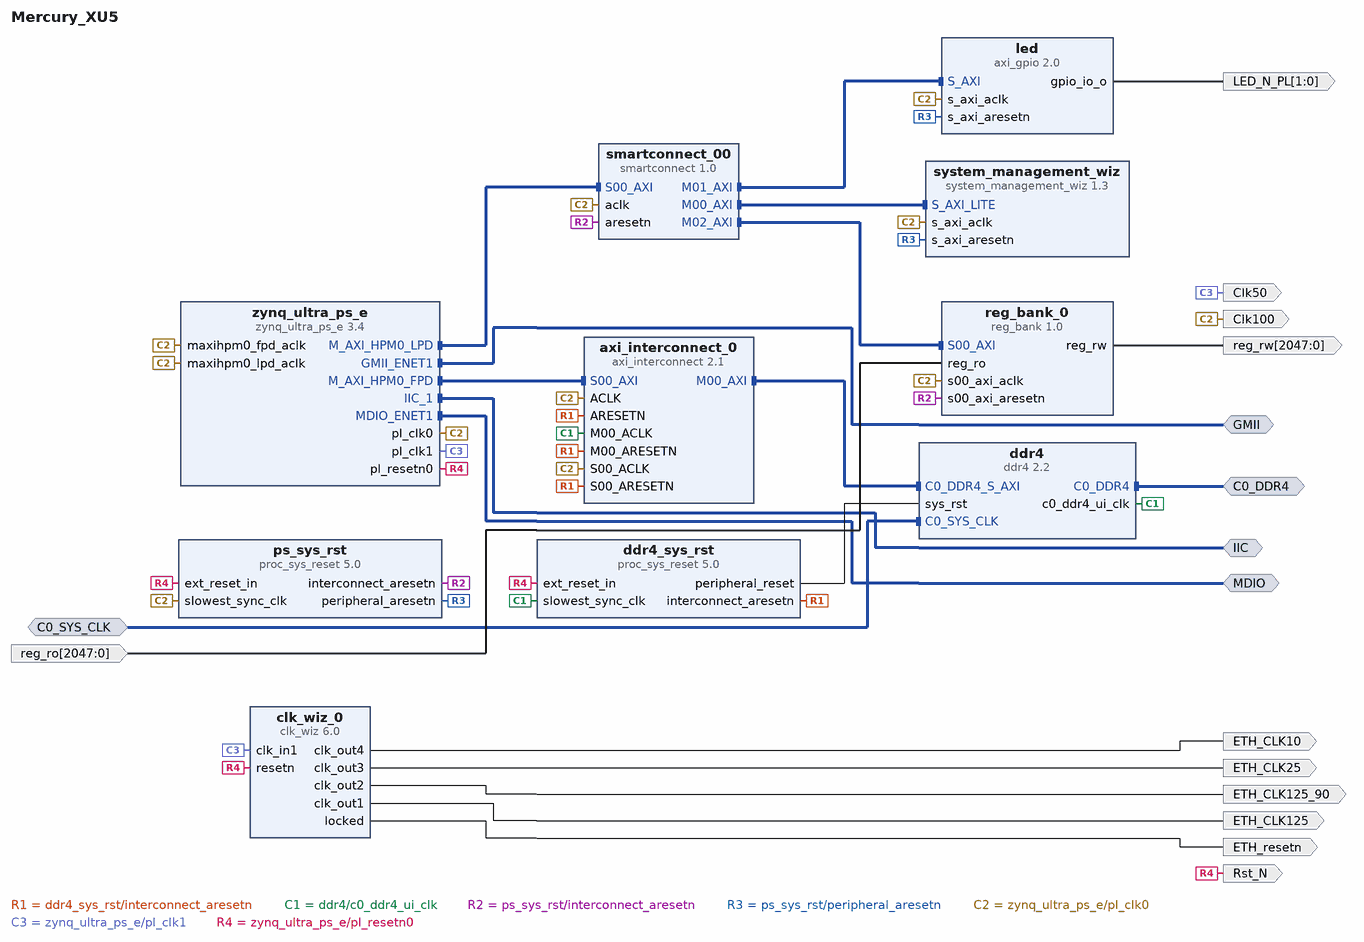
[diagram p0: block diagram of the top level]
# Vivado block design Mercury_XU5, xczu2eg-sfvc784-1-i, Vivado 2022.2
create_bd_design Mercury_XU5

create_bd_intf_port -mode Master -vlnv xilinx.com:interface:iic_rtl:1.0 IIC
create_bd_intf_port -mode Slave -vlnv xilinx.com:interface:diff_clock_rtl:1.0 C0_SYS_CLK
create_bd_intf_port -mode Master -vlnv xilinx.com:interface:ddr4_rtl:1.0 C0_DDR4
create_bd_intf_port -mode Master -vlnv xilinx.com:interface:gmii_rtl:1.0 GMII
create_bd_intf_port -mode Master -vlnv xilinx.com:interface:mdio_rtl:1.0 MDIO
create_bd_port -dir O -type clk ETH_CLK125
create_bd_port -dir O -type clk ETH_CLK125_90
create_bd_port -dir O -type clk ETH_CLK25
create_bd_port -dir O -type clk ETH_CLK10
create_bd_port -dir O ETH_resetn
create_bd_port -dir O -type clk Clk100
create_bd_port -dir O -type clk Clk50
create_bd_port -dir O -type rst Rst_N
create_bd_port -dir O -from 1 -to 0 LED_N_PL
create_bd_port -dir I -from 2047 -to 0 -type data reg_ro
create_bd_port -dir O -from 2047 -to 0 -type data reg_rw

create_bd_cell -type ip -vlnv xilinx.com:ip:zynq_ultra_ps_e:3.4 zynq_ultra_ps_e
set_property -dict [list \
  CONFIG.PSU_BANK_0_IO_STANDARD LVCMOS18 \
  CONFIG.PSU_BANK_1_IO_STANDARD LVCMOS18 \
  CONFIG.PSU_BANK_2_IO_STANDARD LVCMOS18 \
  CONFIG.PSU_BANK_3_IO_STANDARD LVCMOS18 \
  CONFIG.PSU_USB3__DUAL_CLOCK_ENABLE 1 \
  CONFIG.PSU__CRF_APB__DDR_CTRL__FREQMHZ 1200 \
  CONFIG.PSU__CRL_APB__PL1_REF_CTRL__FREQMHZ 50 \
  CONFIG.PSU__CRL_APB__QSPI_REF_CTRL__FREQMHZ 200 \
  CONFIG.PSU__CRL_APB__QSPI_REF_CTRL__SRCSEL RPLL \
  CONFIG.PSU__DDRC__BUS_WIDTH {64 Bit} \
  CONFIG.PSU__DDRC__DEVICE_CAPACITY {4096 MBits} \
  CONFIG.PSU__DDRC__DRAM_WIDTH {16 Bits} \
  CONFIG.PSU__DDRC__ECC Enabled \
  CONFIG.PSU__DDRC__SPEED_BIN DDR4_2400T \
  CONFIG.PSU__DDR_HIGH_ADDRESS_GUI_ENABLE 0 \
  CONFIG.PSU__DDR__INTERFACE__FREQMHZ 600.000 \
  CONFIG.PSU__DLL__ISUSED 1 \
  CONFIG.PSU__ENET0__GRP_MDIO__ENABLE 1 \
  CONFIG.PSU__ENET0__GRP_MDIO__IO {MIO 76 .. 77} \
  CONFIG.PSU__ENET0__PERIPHERAL__ENABLE 1 \
  CONFIG.PSU__ENET0__PERIPHERAL__IO {MIO 26 .. 37} \
  CONFIG.PSU__ENET1__GRP_MDIO__ENABLE 1 \
  CONFIG.PSU__ENET1__GRP_MDIO__IO EMIO \
  CONFIG.PSU__ENET1__PERIPHERAL__ENABLE 1 \
  CONFIG.PSU__ENET1__PERIPHERAL__IO EMIO \
  CONFIG.PSU__FPGA_PL1_ENABLE 1 \
  CONFIG.PSU__GEM__TSU__ENABLE 0 \
  CONFIG.PSU__GPIO0_MIO__IO {MIO 0 .. 25} \
  CONFIG.PSU__GPIO0_MIO__PERIPHERAL__ENABLE 1 \
  CONFIG.PSU__GPIO1_MIO__IO {MIO 26 .. 51} \
  CONFIG.PSU__GPIO1_MIO__PERIPHERAL__ENABLE 1 \
  CONFIG.PSU__GPIO2_MIO__IO {MIO 52 .. 77} \
  CONFIG.PSU__GPIO2_MIO__PERIPHERAL__ENABLE 1 \
  CONFIG.PSU__I2C0__PERIPHERAL__ENABLE 1 \
  CONFIG.PSU__I2C0__PERIPHERAL__IO {MIO 10 .. 11} \
  CONFIG.PSU__I2C1__PERIPHERAL__ENABLE 1 \
  CONFIG.PSU__I2C1__PERIPHERAL__IO EMIO \
  CONFIG.PSU__MAXIGP0__DATA_WIDTH 128 \
  CONFIG.PSU__QSPI_COHERENCY 0 \
  CONFIG.PSU__QSPI_ROUTE_THROUGH_FPD 0 \
  CONFIG.PSU__QSPI__GRP_FBCLK__ENABLE 1 \
  CONFIG.PSU__QSPI__GRP_FBCLK__IO {MIO 6} \
  CONFIG.PSU__QSPI__PERIPHERAL__DATA_MODE x4 \
  CONFIG.PSU__QSPI__PERIPHERAL__ENABLE 1 \
  CONFIG.PSU__QSPI__PERIPHERAL__IO {MIO 0 .. 5} \
  CONFIG.PSU__QSPI__PERIPHERAL__MODE Single \
  CONFIG.PSU__SD0__CLK_200_SDR_OTAP_DLY 0x3 \
  CONFIG.PSU__SD0__CLK_50_DDR_ITAP_DLY 0x12 \
  CONFIG.PSU__SD0__CLK_50_DDR_OTAP_DLY 0x6 \
  CONFIG.PSU__SD0__CLK_50_SDR_ITAP_DLY 0x15 \
  CONFIG.PSU__SD0__CLK_50_SDR_OTAP_DLY 0x6 \
  CONFIG.PSU__SD0__DATA_TRANSFER_MODE 8Bit \
  CONFIG.PSU__SD0__PERIPHERAL__ENABLE 1 \
  CONFIG.PSU__SD0__PERIPHERAL__IO {MIO 13 .. 22} \
  CONFIG.PSU__SD0__SLOT_TYPE eMMC \
  CONFIG.PSU__SD1_COHERENCY 0 \
  CONFIG.PSU__SD1_ROUTE_THROUGH_FPD 0 \
  CONFIG.PSU__SD1__CLK_50_SDR_ITAP_DLY 0x15 \
  CONFIG.PSU__SD1__CLK_50_SDR_OTAP_DLY 0x5 \
  CONFIG.PSU__SD1__DATA_TRANSFER_MODE 4Bit \
  CONFIG.PSU__SD1__GRP_CD__ENABLE 1 \
  CONFIG.PSU__SD1__GRP_CD__IO {MIO 45} \
  CONFIG.PSU__SD1__GRP_POW__ENABLE 0 \
  CONFIG.PSU__SD1__GRP_WP__ENABLE 0 \
  CONFIG.PSU__SD1__PERIPHERAL__ENABLE 1 \
  CONFIG.PSU__SD1__PERIPHERAL__IO {MIO 46 .. 51} \
  CONFIG.PSU__SD1__SLOT_TYPE {SD 2.0} \
  CONFIG.PSU__TSU__BUFG_PORT_PAIR 0 \
  CONFIG.PSU__TTC0__CLOCK__ENABLE 0 \
  CONFIG.PSU__TTC0__PERIPHERAL__ENABLE 1 \
  CONFIG.PSU__TTC0__WAVEOUT__ENABLE 0 \
  CONFIG.PSU__UART0__BAUD_RATE 115200 \
  CONFIG.PSU__UART0__MODEM__ENABLE 0 \
  CONFIG.PSU__UART0__PERIPHERAL__ENABLE 1 \
  CONFIG.PSU__UART0__PERIPHERAL__IO {MIO 38 .. 39} \
  CONFIG.PSU__USB0_COHERENCY 0 \
  CONFIG.PSU__USB0__PERIPHERAL__ENABLE 1 \
  CONFIG.PSU__USB0__PERIPHERAL__IO {MIO 52 .. 63} \
  CONFIG.PSU__USB1__PERIPHERAL__ENABLE 1 \
  CONFIG.PSU__USB1__PERIPHERAL__IO {MIO 64 .. 75} \
  CONFIG.PSU__USB2_0__EMIO__ENABLE 0 \
  CONFIG.PSU__USB3_0__PERIPHERAL__ENABLE 0 \
  CONFIG.PSU__USB__RESET__MODE {Boot Pin} \
  CONFIG.PSU__USB__RESET__POLARITY {Active Low} \
  CONFIG.PSU__USE__M_AXI_GP0 1 \
] [get_bd_cells zynq_ultra_ps_e]
# 94 more settings of zynq_ultra_ps_e are not shown: defaults, MIO pin electricals, DDR timing, and values the tool derives
create_bd_cell -type ip -vlnv xilinx.com:ip:system_management_wiz:1.3 system_management_wiz
set_property -dict {CONFIG.CHANNEL_ENABLE_VP_VN false CONFIG.TEMPERATURE_ALARM_OT_TRIGGER 85} [get_bd_cells system_management_wiz]
create_bd_cell -type ip -vlnv xilinx.com:ip:axi_gpio:2.0 led
set_property -dict {CONFIG.C_ALL_OUTPUTS 1 CONFIG.C_DOUT_DEFAULT 0x00000003 CONFIG.C_GPIO_WIDTH 2} [get_bd_cells led]
create_bd_cell -type ip -vlnv xilinx.com:ip:ddr4:2.2 ddr4
set_property -dict [list \
  CONFIG.C0.DDR4_CasLatency 16 \
  CONFIG.C0.DDR4_CasWriteLatency 11 \
  CONFIG.C0.DDR4_DataWidth 16 \
  CONFIG.C0.DDR4_InputClockPeriod 10006 \
  CONFIG.C0.DDR4_MemoryPart MT40A256M16GE-083E \
  CONFIG.C0.DDR4_TimePeriod 938 \
] [get_bd_cells ddr4]
create_bd_cell -type ip -vlnv xilinx.com:ip:axi_interconnect:2.1 axi_interconnect_0
set_property -dict {CONFIG.M01_HAS_REGSLICE 3 CONFIG.NUM_MI 1} [get_bd_cells axi_interconnect_0]
create_bd_cell -type ip -vlnv xilinx.com:ip:clk_wiz:6.0 clk_wiz_0
set_property -dict [list \
  CONFIG.CLKIN1_JITTER_PS 200.0 \
  CONFIG.CLKOUT1_JITTER 129.582 \
  CONFIG.CLKOUT1_PHASE_ERROR 150.623 \
  CONFIG.CLKOUT1_REQUESTED_OUT_FREQ 125.000 \
  CONFIG.CLKOUT2_JITTER 129.583 \
  CONFIG.CLKOUT2_PHASE_ERROR 150.623 \
  CONFIG.CLKOUT2_REQUESTED_OUT_FREQ 125.000 \
  CONFIG.CLKOUT2_REQUESTED_PHASE 90 \
  CONFIG.CLKOUT2_USED true \
  CONFIG.CLKOUT3_JITTER 181.251 \
  CONFIG.CLKOUT3_PHASE_ERROR 150.623 \
  CONFIG.CLKOUT3_REQUESTED_OUT_FREQ 100.000 \
  CONFIG.CLKOUT3_USED true \
  CONFIG.CLKOUT4_JITTER 241.956 \
  CONFIG.CLKOUT4_PHASE_ERROR 150.623 \
  CONFIG.CLKOUT4_REQUESTED_OUT_FREQ 100.000 \
  CONFIG.CLKOUT4_USED true \
  CONFIG.MMCM_CLKFBOUT_MULT_F 25.000 \
  CONFIG.MMCM_CLKIN1_PERIOD 20.000 \
  CONFIG.MMCM_CLKIN2_PERIOD 10.0 \
  CONFIG.MMCM_CLKOUT0_DIVIDE_F 10.0 \
  CONFIG.MMCM_CLKOUT1_DIVIDE 10 \
  CONFIG.MMCM_CLKOUT1_PHASE 90 \
  CONFIG.MMCM_CLKOUT2_DIVIDE 50 \
  CONFIG.MMCM_CLKOUT3_DIVIDE 125 \
  CONFIG.MMCM_DIVCLK_DIVIDE 1 \
  CONFIG.NUM_OUT_CLKS 4 \
  CONFIG.OVERRIDE_MMCM true \
  CONFIG.PRIM_IN_FREQ 49.9995 \
  CONFIG.PRIM_SOURCE Global_buffer \
  CONFIG.RESET_PORT resetn \
  CONFIG.RESET_TYPE ACTIVE_LOW \
  CONFIG.USE_LOCKED true \
] [get_bd_cells clk_wiz_0]
create_bd_cell -type ip -vlnv xilinx.com:ip:proc_sys_reset:5.0 ps_sys_rst
create_bd_cell -type ip -vlnv xilinx.com:ip:proc_sys_reset:5.0 ddr4_sys_rst
create_bd_cell -type ip -vlnv xilinx.com:ip:smartconnect:1.0 smartconnect_00
set_property -dict {CONFIG.NUM_CLKS 1 CONFIG.NUM_MI 4 CONFIG.NUM_SI 1} [get_bd_cells smartconnect_00]
create_bd_cell -type ip -vlnv user.org:user:reg_bank:1.0 reg_bank_0

# ---- connections ----

connect_bd_intf_net [get_bd_intf_ports C0_SYS_CLK] [get_bd_intf_pins ddr4/C0_SYS_CLK]
connect_bd_intf_net [get_bd_intf_pins axi_interconnect_0/S00_AXI] [get_bd_intf_pins zynq_ultra_ps_e/M_AXI_HPM0_FPD]
connect_bd_intf_net [get_bd_intf_pins axi_interconnect_0/M00_AXI] [get_bd_intf_pins ddr4/C0_DDR4_S_AXI]
connect_bd_intf_net [get_bd_intf_ports C0_DDR4] [get_bd_intf_pins ddr4/C0_DDR4]
connect_bd_intf_net [get_bd_intf_pins smartconnect_00/M00_AXI] [get_bd_intf_pins system_management_wiz/S_AXI_LITE]
connect_bd_intf_net [get_bd_intf_pins smartconnect_00/M01_AXI] [get_bd_intf_pins led/S_AXI]
connect_bd_intf_net [get_bd_intf_pins smartconnect_00/M02_AXI] [get_bd_intf_pins reg_bank_0/S00_AXI]
connect_bd_intf_net [get_bd_intf_ports GMII] [get_bd_intf_pins zynq_ultra_ps_e/GMII_ENET1]
connect_bd_intf_net [get_bd_intf_ports IIC] [get_bd_intf_pins zynq_ultra_ps_e/IIC_1]
connect_bd_intf_net [get_bd_intf_ports MDIO] [get_bd_intf_pins zynq_ultra_ps_e/MDIO_ENET1]
connect_bd_intf_net [get_bd_intf_pins zynq_ultra_ps_e/M_AXI_HPM0_LPD] [get_bd_intf_pins smartconnect_00/S00_AXI]
connect_bd_net -net ARESETN_1 [get_bd_pins ddr4_sys_rst/interconnect_aresetn] \
  [get_bd_pins axi_interconnect_0/ARESETN] [get_bd_pins axi_interconnect_0/S00_ARESETN] \
  [get_bd_pins axi_interconnect_0/M00_ARESETN]
connect_bd_net -net CLK_ETH10 [get_bd_pins clk_wiz_0/clk_out4] [get_bd_ports ETH_CLK10]
connect_bd_net -net CLK_ETH125_90 [get_bd_pins clk_wiz_0/clk_out2] [get_bd_ports ETH_CLK125_90]
connect_bd_net -net CLK_ETH25 [get_bd_pins clk_wiz_0/clk_out3] [get_bd_ports ETH_CLK25]
connect_bd_net -net ETH_CLK125 [get_bd_pins clk_wiz_0/clk_out1] [get_bd_ports ETH_CLK125]
connect_bd_net [get_bd_pins clk_wiz_0/locked] [get_bd_ports ETH_resetn]
connect_bd_net [get_bd_pins ddr4/c0_ddr4_ui_clk] [get_bd_pins axi_interconnect_0/M00_ACLK] [get_bd_pins ddr4_sys_rst/slowest_sync_clk]
connect_bd_net [get_bd_pins ddr4_sys_rst/peripheral_reset] [get_bd_pins ddr4/sys_rst]
connect_bd_net [get_bd_pins led/gpio_io_o] [get_bd_ports LED_N_PL]
connect_bd_net [get_bd_pins ps_sys_rst/interconnect_aresetn] [get_bd_pins smartconnect_00/aresetn] [get_bd_pins reg_bank_0/s00_axi_aresetn]
connect_bd_net [get_bd_pins ps_sys_rst/peripheral_aresetn] [get_bd_pins system_management_wiz/s_axi_aresetn] [get_bd_pins led/s_axi_aresetn]
connect_bd_net [get_bd_pins reg_bank_0/reg_rw] [get_bd_ports reg_rw]
connect_bd_net [get_bd_ports reg_ro] [get_bd_pins reg_bank_0/reg_ro]
connect_bd_net [get_bd_pins zynq_ultra_ps_e/pl_clk0] \
  [get_bd_pins zynq_ultra_ps_e/maxihpm0_lpd_aclk] [get_bd_pins ps_sys_rst/slowest_sync_clk] \
  [get_bd_pins smartconnect_00/aclk] [get_bd_pins system_management_wiz/s_axi_aclk] [get_bd_pins led/s_axi_aclk] \
  [get_bd_ports Clk100] [get_bd_pins axi_interconnect_0/ACLK] [get_bd_pins axi_interconnect_0/S00_ACLK] \
  [get_bd_pins zynq_ultra_ps_e/maxihpm0_fpd_aclk] [get_bd_pins reg_bank_0/s00_axi_aclk]
connect_bd_net [get_bd_pins zynq_ultra_ps_e/pl_clk1] [get_bd_pins clk_wiz_0/clk_in1] [get_bd_ports Clk50]
connect_bd_net [get_bd_pins zynq_ultra_ps_e/pl_resetn0] \
  [get_bd_pins ps_sys_rst/ext_reset_in] [get_bd_pins ddr4_sys_rst/ext_reset_in] [get_bd_pins clk_wiz_0/resetn] \
  [get_bd_ports Rst_N]

# ---- address map ----
assign_bd_address -offset 0x0080000000 -range 64K -target_address_space [get_bd_addr_spaces zynq_ultra_ps_e/Data] [get_bd_addr_segs led/S_AXI/Reg]
assign_bd_address -offset 0x0080010000 -range 64K -target_address_space [get_bd_addr_spaces zynq_ultra_ps_e/Data] [get_bd_addr_segs system_management_wiz/S_AXI_LITE/Reg]
assign_bd_address -offset 0x0080020000 -range 64K -target_address_space [get_bd_addr_spaces zynq_ultra_ps_e/Data] [get_bd_addr_segs reg_bank_0/S00_AXI/S00_AXI_reg]
assign_bd_address -offset 0x0400000000 -range 512M -target_address_space [get_bd_addr_spaces zynq_ultra_ps_e/Data] [get_bd_addr_segs ddr4/C0_DDR4_MEMORY_MAP/C0_DDR4_ADDRESS_BLOCK]

validate_bd_design
save_bd_design
